# Altium project Custom microSD Card Reader.PrjPcb
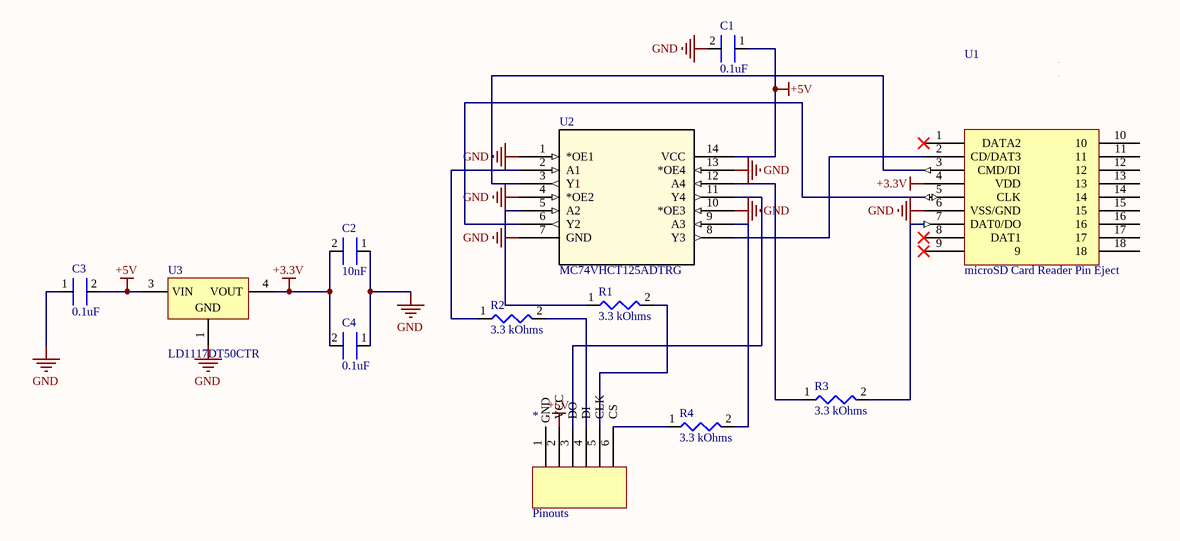
[diagram p0: Sheet1.SchDoc]
1 sheet, 12 parts. Net scope: global (net labels, ports and power ports of the same name join across sheets).
Board file: PCB1.PcbDoc

## Sheet Sheet1.SchDoc
size A4; SheetNumber: 1; SheetTotal: 1

### Parts
*  Pinouts
C1  0.1uF  [CAPC2012X14N_1_35mm_HEIGHT]
C2  10nF  [CAPC2012X07N_06mmHEIGHT]
C3  0.1uF  [CAPC2012X14N_1_35mm_HEIGHT]
C4  0.1uF  [CAPC2012X14N_1_35mm_HEIGHT]
R1  3.3 kOhms  [RESC2012X06N]
R2  3.3 kOhms  [RESC2012X06N]
R3  3.3 kOhms  [RESC2012X06N]
R4  3.3 kOhms  [RESC2012X06N]
U1  microSD Card Reader Pin Eject
U2  MC74VHCT125ADTRG  [TSSOP14_4P50X5P10_ONS]
U3  LD1117DT50CTR  [TO-252_M]

### Nets
+3.3V: C2.2 C4.2 U3.4(VOUT)
+5V: C1.1 C3.2 U2.14(VCC) U3.3(VIN)
GND: C1.2 C2.1 C3.1 C4.1 U2.1(*OE1) U2.4(*OE2) U2.7(GND) U2.10(*OE3) U2.13(*OE4) U3.1(GND)
NetR1_1: R1.1 U2.5(A2)
NetR2_1: R2.1 U2.2(A1)
NetR3_1: R3.1 U2.12(A4)
NetR4_2: R4.2 U2.9(A3)

Not connected (* = marked no-connect by the designer): * 1(GND) 2(VCC) 3(DO) 4(DI) 5(CLK) 6(CS); R1 2; R2 2; R3 2; R4 1; U1 1(DATA2) 2(CD/DAT3) 3(CMD/DI) 4(VDD) 5(CLK) 6(VSS/GND) 7(DAT0/DO) 8(DAT1) 9 10 11 12 13 14 15 16 17 18; U2 3(Y1) 6(Y2) 8(Y3) 11(Y4)

### Notes on the sheet
- Labels drawn without touching a wire or pin: +3.3V, +5V, GND

### Library data of the parts
C1 C3 C4 = CC0805JPX7R8BB104: Capacitor Multilayer Ceramic MLCC - SMD/SMT 25 V 0.1uF X7R 0805 5%; Manufacturer: Yageo; Supplier 1: Mouser; Manufacturer Part Number: CC0805JPX7R8BB104; RoHS: Yes; Category: Ceramic Capacitors; Stock 1: 164887; Pricing 1: 1=0.14000, 10=0.09400, 50=0.09400, 100=0.04800, 1000=0.02900, 10000=0.02300 (USD); RoHS Compliant: Yes; Supplier Part Number 1: 603-CC0805JPX7R8BB10
C2 = CC0805JRX7R9BB103: Capacitor Multilayer Ceramic MLCC - SMD/SMT 50V 10nF X7R 0805 5%; Manufacturer: Yageo; Dissipation Factor: 2.5%; Insulation Resistance: 10GR; Supplier 1: Mouser; Manufacturer Part Number: CC0805JRX7R9BB103; RoHS: Yes; Category: Ceramic Capacitors; Stock 1: 102180; Pricing 1: 1=0.12000, 10=0.05000, 50=0.05000, 100=0.04100, 1000=0.02400, 10000=0.01700 (USD); Mounting Technology: Surface Mount; Case/Package: 0805; Pins: 2; Case Code (Imperial): 0805; Case Code (Metric): 2012; Min Operating Temperature: -55°C; Max Operating Temperature: 125°C; Voltage Rating (DC): 50V; Tolerance: 5%; Packaging: Tape and Reel; Value: 10nF; Voltage Rating: 50V; Package Quantity: 4000; Dielectric: X7R; Termination: SMD/SMT; Resistor Type: Ceramic; Series: CC; Construction: Flat; Length: 2mm; Width: 0.049inch; Height: 0.6mm; Thickness: 0.071inch; Depth: 1.25mm; Radiation Hardening: No; Lead Free: Lead Free; Halogen Free: Halogen Free; RoHS Compliant: Yes; ComponentLink1URL: https://datasheet.ciiva.com/26862/getdatasheetpartid-251801-26862952.pdf?src-supplier=Verical; ComponentLink1Description: https://datasheet.ciiva.com/26862/getdatasheetpartid-251801-26862952.pdf?src-supplier=Verical; ComponentLink2URL: https://datasheet.ciiva.com/11583/upy-gphc-x7r-6-3v-to-50v-8-11583532.pdf?src-supplier=Avnet; ComponentLink2Description: https://datasheet.ciiva.com/11583/upy-gphc-x7r-6-3v-to-50v-8-11583532.pdf?src-supplier=Avnet; ComponentLink3URL: https://datasheet.ciiva.com/13385/upy-gphc-x7r-6-3v-to-50v-8-13385902.pdf?src-supplier=Mouser; ComponentLink3Description: https://datasheet.ciiva.com/13385/upy-gphc-x7r-6-3v-to-50v-8-13385902.pdf?src-supplier=Mouser; Supplier Part Number 1: 603-CC805JRX7R9BB103
R1-R4 = RC0805FR-7W3K3L Yageo: 3.3 kOhms ±1% 0.25W, 1/4W Chip Resistor 0805 (2012 Metric) Moisture Resistant Thick Film; Manufacturer: Yageo; Supplier 1: Avnet; Manufacturer Part Number: RC0805FR-7W3K3L; RoHS: Yes; Category: Chip SMD Resistors; Pricing 1: 5000=0.00430, 10000=0.00424, 20000=0.00411 (USD); Supplier Part Number 1: RC0805FR-7W3K3L
U1 = 504528-0892: Manufacturer: Molex; Manufacturer Part Number: 504528-0892-CUT-TAPE; Supplier: Newark; Supplier Part Number: 90AJ3843; RoHS: No; Pricing: 1=2.82, 10=2.58, 25=2.42, 50=2.26, 100=2.11, 250=1.92 (USD)
U2 = MC74VHCT125ADTRG: Bus Driver, AHCT/VHCT Series, 4-Func, 1-Bit, True Output, CMOS, PDSO14; Manufacturer: ON Semiconductor; Package Body Material: Plastic; Control Type: ENABLE LOW; Load Capacitance (CL): 50pF; Max I(ol): 8mA; Number of Bits: 1; Channels: 4; Number of Ports: 2; Output Characteristics: 3-STATE; Package Equivalence Code: TSSOP14,.25; Power Supplies: 5V; Power Supply Current-Max (ICC): 1.65mA; Prop. Delay@Nom-Sup: 10.5ns; Propagation Delay (tpd): 16ns; Max Supply Voltage: 5.5V; Min Supply Voltage: 4.5V; Time @ Peak Reflow Temperature-Max (s): 40s; Qualification Status: Not Qualified; Supplier: Digi-Key; Supplier Part Number: MC74VHCT125ADTRGOSCT-ND; Manufacturer Part Number: MC74VHCT125ADTRG; RoHS: Yes; Category: Amplifiers - Op Amps, Buffer, Instrumentation; Stock: 452; Pricing: 1=0.63, 10=0.544, 25=0.5072, 100=0.3768, 250=0.31884, 500=0.30436, 1000=0.22465 (USD); Case/Package: TSSOP; Pins: 14; Package Shape: Rectangular; Terminal Finish: Nickel; Min Operating Temperature: -55°C; Max Operating Temperature: 125°C; JESD-609 Code: e4; Output Polarity: True; JESD-30 Code: R-PDSO-G14; Logic Type: BUS DRIVER; Moisture Sensitivity Level: 1; Package Style: SMALL OUTLINE, THIN PROFILE, SHRINK PITCHMeter; Packaging: Tape and Reel; Peak Reflow Temperature (Cel): 260°C; Nominal Supply Voltage: 5V; Surface Mount: Yes; Technology: CMOS; Terminal Form: Gull Wing; Terminal Position: DUAL; Length: 5mm; Width: 4.4mm; Height - Seated (Max): 1.2mm; Terminal Pitch: 0.65mm; Temperature Grade: MILITARY; Reach SVHC Compliant: Yes; RoHS Compliant: Yes; ComponentLink1URL: https://datasheet.ciiva.com:443/pdfs/VipMasterIC/IC/ONSM/ONSM-S-A0001342078/ONSM-S-A0001342078-1.pdf?src-supplier=IHS+Markit; ComponentLink1Description: https://datasheet.ciiva.com:443/pdfs/VipMasterIC/IC/ONSM/ONSM-S-A0001342078/ONSM-S-A0001342078-1.pdf?src-supplier=IHS+Markit; ComponentLink2URL: https://datasheet.ciiva.com/1834/mc74vhct125a-d-1834115.pdf?src-supplier=Digi-Key; ComponentLink2Description: https://datasheet.ciiva.com/1834/mc74vhct125a-d-1834115.pdf?src-supplier=Digi-Key; ComponentLink3URL: https://datasheet.ciiva.com/15094/getdatasheetpartid-37268-15094073.pdf?src-supplier=Verical; ComponentLink3Description: https://datasheet.ciiva.com/15094/getdatasheetpartid-37268-15094073.pdf?src-supplier=Verical; ComponentLink4URL: https://datasheet.ciiva.com/8260/mc74vhct125a-d-8260509.pdf?src-supplier=Avnet; ComponentLink4Description: https://datasheet.ciiva.com/8260/mc74vhct125a-d-8260509.pdf?src-supplier=Avnet; ComponentLink5URL: https://datasheet.ciiva.com/8305/mc74vhct125a-d-8305391.pdf?src-supplier=Avnet; ComponentLink5Description: https://datasheet.ciiva.com/8305/mc74vhct125a-d-8305391.pdf?src-supplier=Avnet; ComponentLink6URL: https://datasheet.ciiva.com/1834/mc74vhct125a-d-1834116.pdf?src-supplier=Digi-Key; ComponentLink6Description: https://datasheet.ciiva.com/1834/mc74vhct125a-d-1834116.pdf?src-supplier=Digi-Key; ComponentLink7URL: https://datasheet.ciiva.com/1834/mc74vhct125a-d-1834117.pdf?src-supplier=Digi-Key; ComponentLink7Description: https://datasheet.ciiva.com/1834/mc74vhct125a-d-1834117.pdf?src-supplier=Digi-Key
U3 = CMP-0244-00109-1: Fixed Low Drop Positive Voltage Regulator, 5V, 3-Pin DPAK, Tape and Reel; ComponentLink2URL: http://www.st.com/internet/com/TECHNICAL_RESOURCES/TECHNICAL_LITERATURE/DATASHEET/CD00000544.pdf; ComponentLink1URL: http://www.st.com; PackageReference: TO-252; DatasheetVersion: 1/11/2011; ComponentLink1Description: Manufacturer URL; PackageVersion: 2011; ComponentLink2Description: Datasheet; PackageDescription: 3-Pin Transistor Outline Package 2.28 mm Pitch, 9.7 mm Lead Span (DPAK)